# Altium schematic sheet final.SchDoc
size A; SheetNumber: 1; SheetTotal: 3
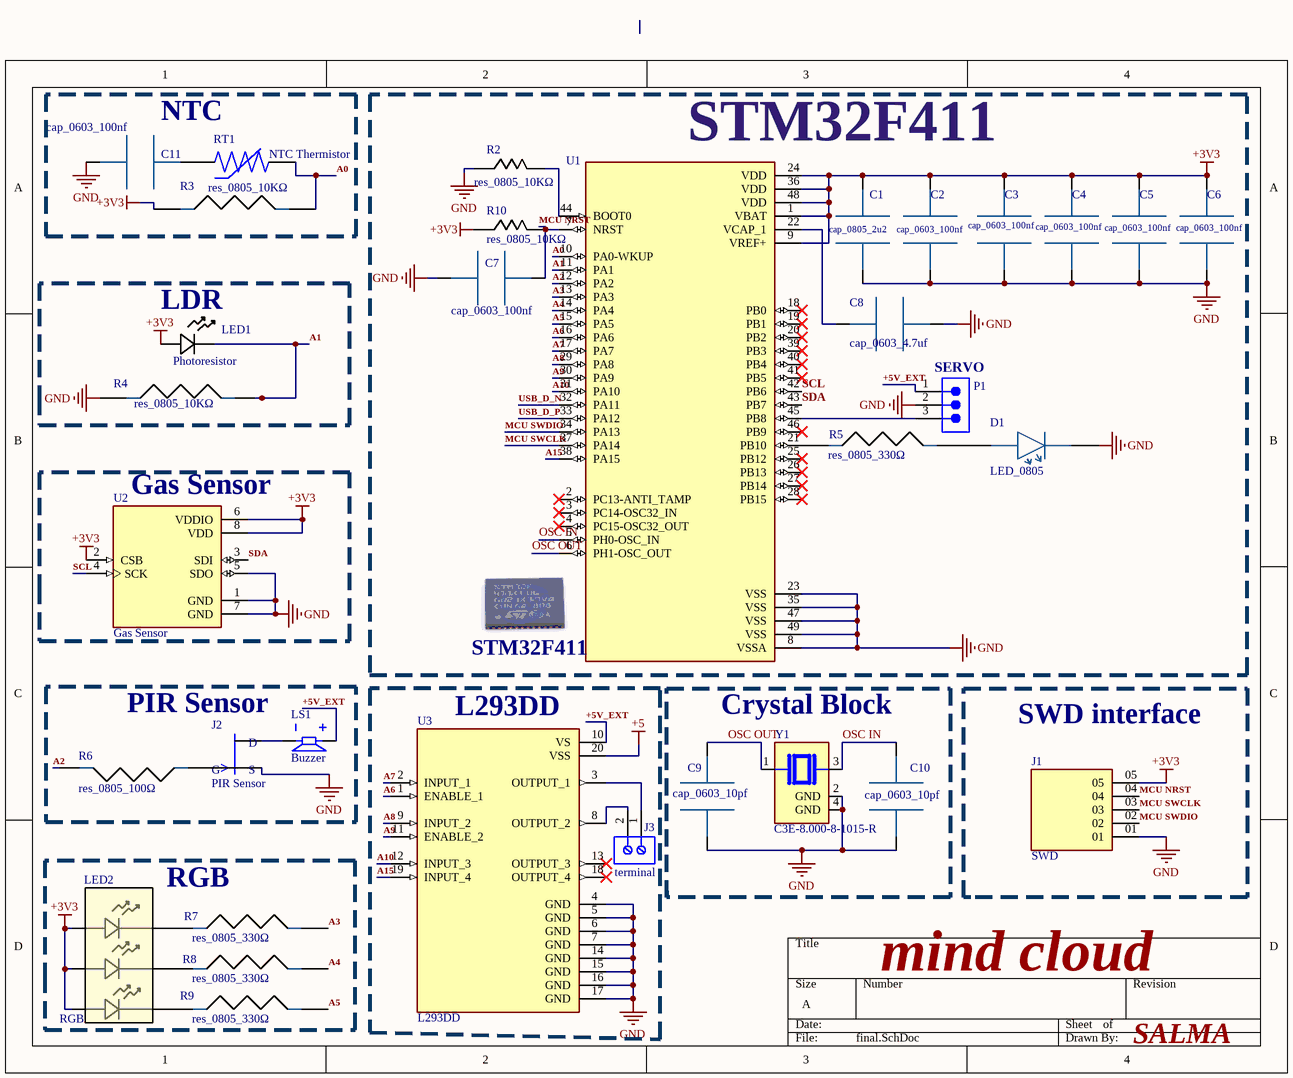
[diagram p0: final.SchDoc]

## Parts
C1  cap_0805_2u2  [capa0805]
C2  cap_0603_100nf  [capa0805]
C3  cap_0603_100nf  [capa0805]
C4  cap_0603_100nf  [capa0805]
C5  cap_0603_100nf  [capa0805]
C6  cap_0603_100nf  [capa0805]
C7  cap_0603_100nf  [capa0805]
C8  cap_0603_4.7uf  [capa0805]
C9  cap_0603_10pf  [capa0805]
C10  cap_0603_10pf  [capa0805]
C11  cap_0603_100nf  [capa0805]
D1  LED_0805  [LED_0805]
J1  SWD  [SAMTEC_MTSW-105-07-T-S-165]
J2  PIR Sensor  [PIR Sensor]
J3  terminal  [691253900002]
LED1  Photoresistor  [Photoresistor]
LED2  RGB  [RGB]
LS1  Buzzer  [Buzzer]
P1  SERVO  [691386700003]
R2  res_0805_10KΩ  [Res_0805]
R3  res_0805_10KΩ  [Res_0805]
R4  res_0805_10KΩ  [Res_0805]
R5  res_0805_330Ω  [Res_0805]
R6  res_0805_100Ω  [Res_0805]
R7  res_0805_330Ω  [Res_0805]
R8  res_0805_330Ω  [Res_0805]
R9  res_0805_330Ω  [Res_0805]
R10  res_0805_10KΩ  [Res_0805]
RT1  NTC Thermistor  [NTC Thermistor]
U1  STM32F411  [STM32F411]
U2  Gas Sensor  [Gas Sensor]
U3  L293DD  [L293DD]
Y1  C3E-8.000-8-1015-R  [C3E-8.000-8-1015-R]

## Blocks framed on the sheet
NTC: C11 R3 RT1
STM32F411: C1-C8 D1 P1 R2 R5 R10 U1
PIR Sensor: J2 LS1 R6
L293DD: J3 U3

## Nets
+3V3: C1.2 C2.2 C3.2 C4.2 C5.2 C6.2 J1.05 LED1.2(ANODE) LED2.1 LED2.2 LED2.3 R3.1 R10.1 U1.1(VBAT) U1.9(VREF+) U1.24(VDD) U1.36(VDD) U1.48(VDD) U2.2(CSB) U2.6(VDDIO) U2.8(VDD)
+5: U3.20(VSS)
GND: C1.1 C2.1 C3.1 C4.1 C5.1 C6.1 C7.1 C8.2 C9.1 C10.1 C11.1 D1.2 J1.01 J2.2(S) P1.2 R2.1 R4.1 U1.8(VSSA) U1.23(VSS) U1.35(VSS) U1.47(VSS) U1.49(VSS) U2.1(GND) U2.5(SDO) U2.7(GND) U3.4(GND) U3.5(GND) U3.6(GND) U3.7(GND) U3.14(GND) U3.15(GND) U3.16(GND) U3.17(GND) Y1.2(GND) Y1.4(GND)
+5V_EXT: LS1.P P1.1 U3.10(VS)
A0: R3.2 RT1.2 U1.10(PA0-WKUP)
A1: LED1.1(CATHODE) R4.2 U1.11(PA1)
A2: R6.2 U1.12(PA2)
A3: R7.2 U1.13(PA3)
A4: R8.2 U1.14(PA4)
A5: R9.2 U1.15(PA5)
A6: U1.16(PA6) U3.1(ENABLE_1)
A7: U1.17(PA7) U3.2(INPUT_1)
A8: U1.29(PA8) U3.9(INPUT_2)
A9: U1.30(PA9) U3.11(ENABLE_2)
A10: U1.31(PA10) U3.12(INPUT_3)
A15: U1.38(PA15) U3.19(INPUT_4)
MCU NRST: C7.2 J1.04 R10.2 U1.7(NRST)
MCU SWCLK: J1.03 U1.37(PA14)
MCU SWDIO: J1.02 U1.34(PA13)
OSC IN: C10.2 U1.5(PH0-OSC_IN) Y1.3
OSC OUT: C9.2 U1.6(PH1-OSC_OUT) Y1.1
SCL: U1.42(PB6) U2.4(SCK)
SDA: U1.43(PB7) U2.3(SDI)
USB_D_N: U1.32(PA11)
USB_D_P: U1.33(PA12)
NetC8_1: C8.1 U1.22(VCAP_1)
NetD1_1: D1.1 R5.2
NetJ2_1: J2.1(D) LS1.N
NetJ3_1: J3.1 U3.3(OUTPUT_1)
NetJ3_2: J3.2 U3.8(OUTPUT_2)
NetLED2_4: LED2.4 R9.1
NetLED2_5: LED2.5 R8.1
NetLED2_6: LED2.6 R7.1
NetP1_3: P1.3 U1.45(PB8)
NetR2_2: R2.2 U1.44(BOOT0)
NetR5_1: R5.1 U1.21(PB10)

Not connected (* = marked no-connect by the designer): C11 2; J2 3(G); R6 1; RT1 1; U1 2(PC13-ANTI_TAMP)* 3(PC14-OSC32_IN)* 4(PC15-OSC32_OUT)* 18(PB0)* 19(PB1)* 20(PB2)* 25(PB12)* 26(PB13)* 27(PB14)* 28(PB15)* 39(PB3)* 40(PB4)* 41(PB5)* 46(PB9)*; U3 13(OUTPUT_3)* 18(OUTPUT_4)*

## Notes on the sheet
- (near LED1) LDR
- (near U2) Gas Sensor
- Crystal Block
- (near J1) SWD interface
- RGB
- mind cloud
- SALMA

## Library data of the parts
C1 = cap_0805_2u2: MFR: Samsung Electro-Mechanics; MFR part: CL10A225KO8NNNC; supplier: lcsc; supplier part: C23630; ComponentLink1Description: buy; ComponentLink1URL: https://www.lcsc.com/product-detail/C23630.html?s_z=n_q_capacitor%25200603%25202.2u&spm=wm.fly.bg.0.xh&lcsc_vid=FlldVwBSQFlXXgVVFQBbUAUARABdUVEAEllcVQYAEgMxVlNeT1FXUFJRRFNfVTsOAxUeFF5JWBYZEEoKFBINSQcJGk4dBgkWGwQd
C2-C7 C11 = cap_0603_100nf: MFR: Samsung Electro-Mechanics; MFR part: CL10B104KB8NNNC; supplier: lcsc; supplier part: C1591; ComponentLink1Description: buy; ComponentLink1URL: https://www.lcsc.com/product-detail/C15850.html?spm=wm.fly.bg.2.xh___wm.fly.tp.3.ml&lcsc_vid=EQMKBQFTFldaAV0ERFFdUwBeRAQMVV0CRgdWAlFeEVExVlNeQFBaV1xRQ1ZbUjsOAxUeFF5JWBYZEEoBGA4JCwFIFA4DSA%3D%3D
C8 = cap_0603_4.7uf: MFR: Samsung Electro-Mechanics; MFR part: CL10A475KP8NNNC; supplier: lcsc; supplier part: C1705; ComponentLink1Description: buy; ComponentLink1URL: https://www.lcsc.com/product-detail/C1705.html?s_z=n_q_capacitor%25200603%25204.7u&spm=wm.fly.bg.0.xh&lcsc_vid=FlldVwBSQFlXXgVVFQBbUAUARABdUVEAEllcVQYAEgMxVlNeT1BeUVBTQ1lcVzsOAxUeFF5JWBYZEEoKFBINSQcJGk4dAgUUFAk%3D
C9 C10 = cap_0603_10pf: MFR: Samsung Electro-Mechanics; MFR part: CL10C100JB8NNNC; supplier: lcsc; supplier part: C1634; ComponentLink1Description: buy; ComponentLink1URL: https://www.lcsc.com/product-detail/C1634.html?s_z=n_q_p_Samsung%2520Electro-Mechanics%2520CL21A106KAYNNNE%252010pf&spm=wm.ssy.bg.1.xh&lcsc_vid=EQMKBQFTFldaAV0ERFFdUwBeRAQMVV0CRgdWAlFeEVExVlNeQFlfX1FURVNWXzsOAxUeFF5JWBYZEEoKFBINSQcJGk4eFQsCAgIaSgADAwAHC0slRlRWUlRIHxUDCw%3D%3D
D1 = LED_0805: MFR: YONGYUTAI; MFR part: YLED0805R; supplier: lcsc; supplier part: C19171391; ComponentLink1Description: buy; ComponentLink1URL: https://www.lcsc.com/product-detail/C19171391.html?s_z=n_q_t_LED%25200805&spm=wm.fly.bg.0.xh___wm.ssy.tc.0.tz&lcsc_vid=EQMKBQFTFldaAV0ERFFdUwBeRAQMVV0CRgdWAlFeEVExVlNeQFVbXl1XRlJdUTsOAxUeFF5JWBYZEEoKFBINSQcJGk4eFQsCAgIaSgADAwAHC0slRVlaVFxWTk8GEwkK
J1 = MTSW-105-07-T-S-165: MFR: Samtec; MFR part: MTSW-105-07-T-S-165; supplier: lcsc; supplier part: C3335287; ComponentLink1Description: buy; ComponentLink1URL: https://www.lcsc.com/product-detail/C3335287.html?s_z=n_q_MTSW-105-07-T-S-165&spm=wm.fly.bg.0.xh&lcsc_vid=EQMKBQFTFldaAV0ERFFdUwBeRAQMVV0CRgdWAlFeEVExVlNeQFlfVlVfRVVfVzsOAxUeFF5JWBYZEEoKFBINSQcJGk4dAgUUFAk%3D
J2 = PIR Sensor: MFR: Zilog; MFR part: ZRE200GE; supplier: lcsc; supplier part: C3678733; ComponentLink1Description: buy; ComponentLink1URL: https://www.lcsc.com/product-detail/C3678733.html?s_z=n_q_ZRE200GE&spm=wm.fly.bg.0.xh&lcsc_vid=EQJbUwEATwBfUlMDRFFfBlZSEVNfAV1WQFgPU1dQRAIxVlNeT1JXU1FXRFRaUTsOAxUeFF5JWBYZEEoKFBINSQcJGk4NBhADEA4cHktXRlRbSQwSGg0%3D
J3 = CMP-1502-02710-3: Terminal Block, 7.5MM Pitch, Vertical, Rising Cage Clamp, 12-30 AWG, 2 Pin
LED1 = Photoresistor: MFR: JCHL; MFR part: GL5528(10-20); supplier: lcsc; supplier part: C10081; ComponentLink1Description: buy; ComponentLink1URL: https://www.lcsc.com/product-detail/C10081.html?s_z=n_q_GL5528&spm=wm.fly.bg.1.xh&lcsc_vid=EQJbUwEATwBfUlMDRFFfBlZSEVNfAV1WQFgPU1dQRAIxVlNeTlBYXlFWQFlZUDsOAxUeFF5JWBYZEEoKFBINSQcJGk4NBhADEA4cHktXRVdeSQwSGg0%3D
LED2 = RGB: MFR: Broadcom; MFR part: ASMT-YTD7-0AA02; supplier: lcsc; supplier part: C3018557; ComponentLink1Description: buy; ComponentLink1URL: https://www.lcsc.com/product-detail/C3018557.html?s_z=n_q_ASMT-YTD7-0AA02&spm=wm.fly.bg.0.xh&lcsc_vid=EQJbUwEATwBfUlMDRFFfBlZSEVNfAV1WQFgPU1dQRAIxVlNeTlBZV1JRR1NZVzsOAxUeFF5JWBYZEEoKFBINSQcJGk4eFQsCAgIaSgADAwAHC0slRFFfX1FTQE8GEwkK
LS1 = Buzzer: MFR: CUI; MFR part: CMI-1210-5-95T; supplier: lcsc; supplier part: C6485139; ComponentLink1Description: buy; ComponentLink1URL: https://www.lcsc.com/product-detail/C6485139.html?s_z=n_q_CMI-1210-5-95T&spm=wm.fly.bg.0.xh&lcsc_vid=EQJbUwEATwBfUlMDRFFfBlZSEVNfAV1WQFgPU1dQRAIxVlNeT1JXUVNSQlVaVzsOAxUeFF5JWBYZEEoKFBINSQcJGk4dAgUUFAk%3D
P1 = CMP-1502-02091-3: Terminal Block, 5.00MM, Male Pcb Horizontal/vertical Cab Divisible, 3 Pins; Pitch: 5.0038mm; Number of Levels: 1; Number of Positions: 3; Current: 14A; Voltage: 300V; Orientation: Vertical; Min Operating Temperature: -30°C; Packaging: Box; Number of Pins: 3; Mount: Through Hole; Max Operating Temperature: 130°C; Lead Pitch: 5mm; RoHS: Compliant; Number of Positions Per Level: 3; Termination: Solder; Color: Grey
R2-R4 R10 = res_0805_10KΩ: MFR: YAGEO; MFR part: RC0603FR-0710KL; supplier: lcsc; supplier part: C98220; ComponentLink1Description: buy; ComponentLink1URL: https://www.lcsc.com/product-detail/C98220.html?s_z=n_q_t_Resistors%25200603%252010K%25CE%25A9&spm=wm.fly.bg.0.xh___wm.ssy.tc.0.tz&lcsc_vid=FlldVwBSQFlXXgVVFQBbUAUARABdUVEAEllcVQYAEgMxVlNeT1FXX1FVQFRcVDsOAxUeFF5JWBYZEEoKFBINSQcJGk4dAgUUFAk%3D
R5 R7-R9 = res_0805_330Ω: MFR: UNI-ROYAL; MFR part: 0805W8F3300T5E; supplier: lcsc; supplier part: C17630; ComponentLink1Description: buy; ComponentLink1URL: https://www.lcsc.com/product-detail/C17630.html?s_z=n_q_Resistor%25200805%2520330%25CE%25A9&spm=wm.fly.bg.0.xh&lcsc_vid=EQJbUwEATwBfUlMDRFFfBlZSEVNfAV1WQFgPU1dQRAIxVlNeTlBWVlZXT1ldXzsOAxUeFF5JWBYZEEoKFBINSQcJGk4NBhADEA4cHktXRlhXSQwSGg0%3D
R6 = res_0805_100Ω: MFR: YAGEO; MFR part: RC0805FR-07100RL; supplier: lcsc; supplier part: C105577; ComponentLink1Description: buy; ComponentLink1URL: https://www.lcsc.com/product-detail/C2907219.html?s_z=n_q_t_Resistor%25200805%2520100&spm=wm.fly.bg.0.xh___wm.ssy.tc.0.tz&lcsc_vid=EQJbUwEATwBfUlMDRFFfBlZSEVNfAV1WQFgPU1dQRAIxVlNeTlBWV1ZVRFlfUjsOAxUeFF5JWBYZEEoKFBINSQcJGk4NBhADEA4cHktXRVFfSQwSGg0%3D
RT1 = NTC Thermistor: MFR: muRata; MFR part: NCU15WF104D60RC; supplier: lcsc; supplier part: C426654; ComponentLink1Description: buy; ComponentLink1URL: https://www.lcsc.com/product-detail/C426654.html?s_z=n_q_NCU15WF104D60RC&spm=wm.fly.bg.0.xh&lcsc_vid=EQJbUwEATwBfUlMDRFFfBlZSEVNfAV1WQFgPU1dQRAIxVlNeT1JXVFVQQ1ZaVjsOAxUeFF5JWBYZEEoKFBINSQcJGk4NBhADEA4cHktXRVZcSQwSGg0%3D
U1 = STM32F411: MFR: ST; MFR part: STM32F411CEU6; supplier: lcsc; supplier part: C60420; ComponentLink1Description: buy; ComponentLink1URL: https://www.lcsc.com/product-detail/C60420.html?s_z=n_q_STM32F411CEU6&spm=wm.fly.bg.0.xh&lcsc_vid=EQMKBQFTFldaAV0ERFFdUwBeRAQMVV0CRgdWAlFeEVExVlNeQFleUVFVT1hWUzsOAxUeFF5JWBYZEEoKFBINSQcJGk4NBhADEA4cHktfQ1BADxALGw%3D%3D
U2 = Gas Sensor: MFR: Bosch; MFR part: BME688; supplier: lcsc; supplier part: C3664478; ComponentLink1Description: buy; ComponentLink1URL: https://www.lcsc.com/product-detail/C3664478.html?s_z=n_q_x_BME688&spm=wm.ssy.em.0.tz&lcsc_vid=EQJbUwEATwBfUlMDRFFfBlZSEVNfAV1WQFgPU1dQRAIxVlNeT1RcVVRTR1BZXzsOAxUeFF5JWBYZEEoKFBINSQcJGk4dAgUUFAk%3D
U3 = L293DD: MFR: ST; MFR part: L293DD; supplier: lcsc; supplier part: C2971293; ComponentLink1Description: buy; ComponentLink1URL: https://www.lcsc.com/product-detail/C2971293.html?s_z=n_q_x_L293DD&spm=wm.ssy.em.0.tz&lcsc_vid=EQJbUwEATwBfUlMDRFFfBlZSEVNfAV1WQFgPU1dQRAIxVlNeT1JXVVBSTlJaUzsOAxUeFF5JWBYZEEoKFBINSQcJGk4%3D
Y1 = C3E-8.000-8-1015-R: MFR: AKER; MFR part: C3E-8.000-8-1015-R; supplier: lcsc; supplier part: C5588720; ComponentLink1Description: buy; ComponentLink1URL: https://www.lcsc.com/product-detail/C5588720.html?s_z=n_q_C3E-8.000-8-1015-R&spm=wm.fly.bg.0.xh&lcsc_vid=EQMKBQFTFldaAV0ERFFdUwBeRAQMVV0CRgdWAlFeEVExVlNeQFleX1FRT1FXVzsOAxUeFF5JWBYZEEoKFBINSQcJGk4eFQsCAgIaSgADAwAHC0slQVFaVVRIHxUDCw%3D%3D